# Altium project Inflador Automatico.PrjPcb
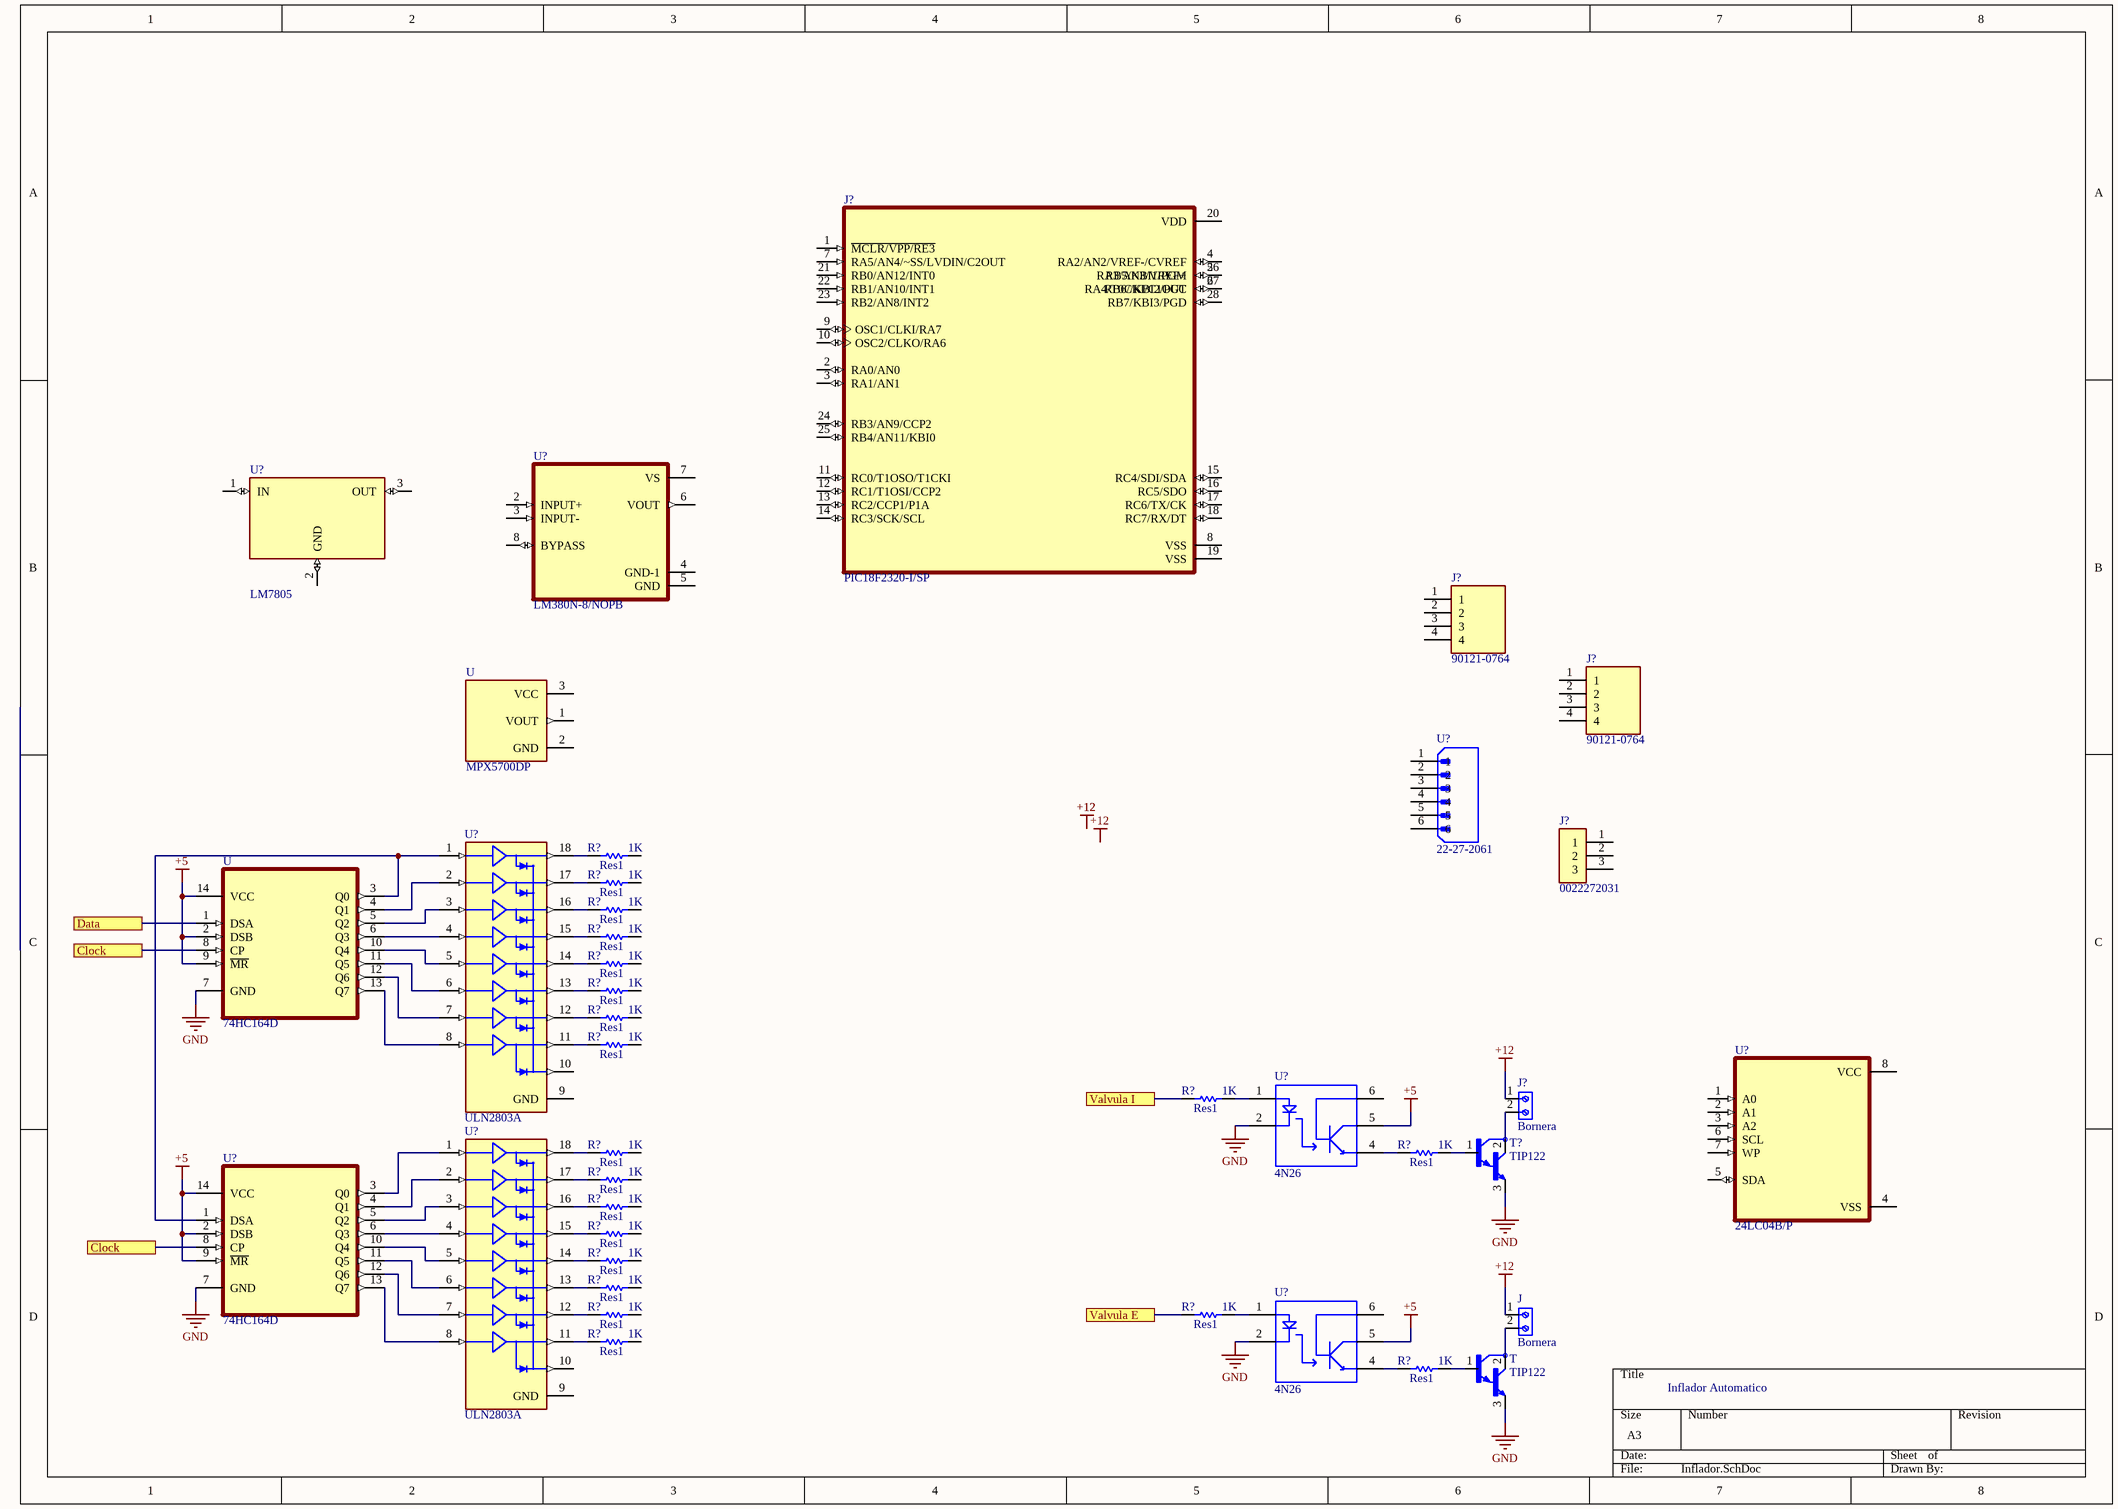
[diagram p0: Inflador.SchDoc]
1 sheet, 39 parts. Net scope: flat (ports and power ports of the same name join across sheets).

## Sheet Inflador.SchDoc
size A3; SheetNumber: 1; SheetTotal: 1

### Parts
(Parts that share a designator on the sheet are numbered #1, #2 ... from top to bottom, then left to right.)
J  Bornera  [691111710002]
J?#1  PIC18F2320-I/SP  [DIP787W46P254L3467H508Q28]
J?#2  90121-0764  [MOLEX_90121-0764]
J?#3  90121-0764  [MOLEX_90121-0764]
J?#4  0022272031  [MOLEX_0022272031]
J?#5  Bornera  [691111710002]
R?#1  Res1  value 1K  [AXIAL-0.3]
R?#2  Res1  value 1K  [AXIAL-0.3]
R?#3  Res1  value 1K  [AXIAL-0.3]
R?#4  Res1  value 1K  [AXIAL-0.3]
R?#5  Res1  value 1K  [AXIAL-0.3]
R?#6  Res1  value 1K  [AXIAL-0.3]
R?#7  Res1  value 1K  [AXIAL-0.3]
R?#8  Res1  value 1K  [AXIAL-0.3]
R?#9  Res1  value 1K  [AXIAL-0.3]
R?#10  Res1  value 1K  [AXIAL-0.3]
R?#11  Res1  value 1K  [AXIAL-0.3]
R?#12  Res1  value 1K  [AXIAL-0.3]
R?#13  Res1  value 1K  [AXIAL-0.3]
R?#14  Res1  value 1K  [AXIAL-0.3]
R?#15  Res1  value 1K  [AXIAL-0.3]
R?#16  Res1  value 1K  [AXIAL-0.3]
R?#17  Res1  value 1K  [AXIAL-0.3]
R?#18  Res1  value 1K  [AXIAL-0.3]
R?#19  Res1  value 1K  [AXIAL-0.3]
R?#20  Res1  value 1K  [AXIAL-0.3]
T  TIP122  [TO220]
T?  TIP122  [TO220]
U#1  MPX5700DP  [XDCR_MPX5700DP]
U#2  74HC164D  [SOIC127P600X175-14N]
U?#1  LM380N-8/NOPB  [DIP794W45P254L959H508Q8]
U?#2  LM7805  [TO220]
U?#3  22-27-2061  [MOLEX_22-27-2061]
U?#4  ULN2803A  [DIP850W46P254L2324H393Q18]
U?#5  4N26  [DIP762W50P254L712H480Q6]
U?#6  24LC04B/P  [DIP787W46P254L927H533Q8]
U?#7  74HC164D  [SOIC127P600X175-14N]
U?#8  ULN2803A  [DIP850W46P254L2324H393Q18]
U?#9  4N26  [DIP762W50P254L712H480Q6]

### Ports
Clock, Data, Valvula E, Valvula I

### Nets
+5: U#2.2(DSB) U#2.9(~{MR}) U#2.14(VCC) U?#5.5(COLLECTOR) U?#7.2(DSB) U?#7.9(~{MR}) U?#7.14(VCC) U?#9.5(COLLECTOR)
+12: J.1 J?#5.1
GND: T.3(E) T?.3(E) U#2.7(GND) U?#5.2(C) U?#7.7(GND) U?#9.2(C)
NetJ?#1_5: J?#1.5(RA3/AN3/VREF+) J?#1.26(RB5/KBI1/PGM)
NetJ?#1_6: J?#1.6(RA4/T0CKI/C1OUT) J?#1.27(RB6//KBI2/PGC)
NetJ?#5_2: J?#5.2 T?.2(C)
NetJ_2: J.2 T.2(C)
NetR?#1_1: R?#1.1 U?#4.18(OUT_1)
NetR?#2_1: R?#2.1 U?#4.17(OUT_2)
NetR?#3_1: R?#3.1 U?#4.16(OUT_3)
NetR?#4_1: R?#4.1 U?#4.15(OUT_4)
NetR?#5_1: R?#5.1 U?#4.14(OUT_5)
NetR?#6_1: R?#6.1 U?#4.13(OUT_6)
NetR?#7_1: R?#7.1 U?#4.12(OUT_7)
NetR?#8_1: R?#8.1 U?#4.11(OUT_8)
NetR?#9_1: R?#9.1 ; port Valvula I
NetR?#9_2: R?#9.2 U?#5.1(A)
NetR?#10_1: R?#10.1 U?#8.18(OUT_1)
NetR?#11_1: R?#11.1 U?#5.4(EMITTER)
NetR?#11_2: R?#11.2 T?.1(B)
NetR?#12_1: R?#12.1 U?#8.17(OUT_2)
NetR?#13_1: R?#13.1 U?#8.16(OUT_3)
NetR?#14_1: R?#14.1 U?#8.15(OUT_4)
NetR?#15_1: R?#15.1 U?#8.14(OUT_5)
NetR?#16_1: R?#16.1 U?#8.13(OUT_6)
NetR?#17_1: R?#17.1 U?#8.12(OUT_7)
NetR?#18_1: R?#18.1 ; port Valvula E
NetR?#18_2: R?#18.2 U?#9.1(A)
NetR?#19_1: R?#19.1 U?#8.11(OUT_8)
NetR?#20_1: R?#20.1 U?#9.4(EMITTER)
NetR?#20_2: R?#20.2 T.1(B)
NetU#2_1: U#2.1(DSA) ; port Data
NetU#2_3: U#2.3(Q0) U?#4.1(IN_1) U?#7.1(DSA)
NetU#2_4: U#2.4(Q1) U?#4.2(IN_2)
NetU#2_5: U#2.5(Q2) U?#4.3(IN_3)
NetU#2_6: U#2.6(Q3) U?#4.4(IN_4)
NetU#2_8: U#2.8(CP) U?#7.8(CP) ; port Clock
NetU#2_10: U#2.10(Q4) U?#4.5(IN_5)
NetU#2_11: U#2.11(Q5) U?#4.6(IN_6)
NetU#2_12: U#2.12(Q6) U?#4.7(IN_7)
NetU#2_13: U#2.13(Q7) U?#4.8(IN_8)
NetU?#7_3: U?#7.3(Q0) U?#8.1(IN_1)
NetU?#7_4: U?#7.4(Q1) U?#8.2(IN_2)
NetU?#7_5: U?#7.5(Q2) U?#8.3(IN_3)
NetU?#7_6: U?#7.6(Q3) U?#8.4(IN_4)
NetU?#7_10: U?#7.10(Q4) U?#8.5(IN_5)
NetU?#7_11: U?#7.11(Q5) U?#8.6(IN_6)
NetU?#7_12: U?#7.12(Q6) U?#8.7(IN_7)
NetU?#7_13: U?#7.13(Q7) U?#8.8(IN_8)

Not connected (* = marked no-connect by the designer): J?#1 1(~{MCLR/VPP/RE3}) 2(RA0/AN0) 3(RA1/AN1) 4(RA2/AN2/VREF-/CVREF) 7(RA5/AN4/~SS/LVDIN/C2OUT) 8(VSS) 9(OSC1/CLKI/RA7) 10(OSC2/CLKO/RA6) 11(RC0/T1OSO/T1CKI) 12(RC1/T1OSI/CCP2) 13(RC2/CCP1/P1A) 14(RC3/SCK/SCL) 15(RC4/SDI/SDA) 16(RC5/SDO) 17(RC6/TX/CK) 18(RC7/RX/DT) 19(VSS) 20(VDD) 21(RB0/AN12/INT0) 22(RB1/AN10/INT1) 23(RB2/AN8/INT2) 24(RB3/AN9/CCP2) 25(RB4/AN11/KBI0) 28(RB7/KBI3/PGD); J?#2 1 2 3 4; J?#3 1 2 3 4; J?#4 1 2 3; R?#1 2; R?#2 2; R?#3 2; R?#4 2; R?#5 2; R?#6 2; R?#7 2; R?#8 2; R?#10 2; R?#12 2; R?#13 2; R?#14 2; R?#15 2; R?#16 2; R?#17 2; R?#19 2; U#1 1(VOUT) 2(GND) 3(VCC); U?#1 2(INPUT+) 3(INPUT-) 4(GND-1) 5(GND) 6(VOUT) 7(VS) 8(BYPASS); U?#2 1(IN) 2(GND) 3(OUT); U?#3 1 2 3 4 5 6; U?#4 9(GND) 10(COMMON); U?#5 6(BASE); U?#6 1(A0) 2(A1) 3(A2) 4(VSS) 5(SDA) 6(SCL) 7(WP) 8(VCC); U?#8 9(GND) 10(COMMON); U?#9 6(BASE)

### Notes on the sheet
- Inflador Automatico
- Labels drawn without touching a wire or pin: +12

### Library data of the parts
J J?#5 = 691111710002: 2 Position Wire to Board Terminal Block Horizontal with Board 0.197 _5.00mm_ Through Hole; MF: Wurth Electronics; Value: *; Availability: Unavailable; MP: 691111710002; Price: None; Package: None; SnapEDA_Link: https://www.snapeda.com/parts/691111710002/Wurth%20Electronics%20Inc./view-part/1195092/?ref=snap
J?#2 J?#3 = 90121-0764: Connector Header Through Hole, Right Angle 4 position 0.100" (2.54mm); Package: None; Price: None; Value: *; MP: 90121-0764; Availability: Unavailable
J?#4 = 0022272031: Connector Header Through Hole 3 position 0.100 (2.54mm); MF: Molex; MP: 0022272031; Price: None; SnapEDA_Link: https://www.snapeda.com/parts/0022272031/Molex/view-part/?ref=snap; Check_prices: https://www.snapeda.com/parts/0022272031/Molex/view-part/?ref=eda; Package: None; Availability: In Stock; Value: *
R?#1-R?#20 = Res1: Resistor; Published: 8-Jun-2000; LatestRevisionDate: 17-Jul-2002; LatestRevisionNote: Re-released for DXP Platform.; PackageReference: AXIAL-0.3; Publisher: Altium Limited; PackageDescription: Axial Device, Thru-Hole; 2 Leads; 0.3 in Pin Spacing
T T? = TIP122: Bipolar _BJT_ Transistor NPN - Darlington 100V 5A 2W Through Hole TO-220AB; MF: ON Semiconductor; Package: TO-220 Fairchild Semiconductor; Value: *; MP: TIP122; Price: None; SnapEDA_Link: https://www.snapeda.com/parts/TIP122/ON%20Semiconductor/view-part/315945/?ref=snap; Availability: Unavailable
U#1 = MPX5700DP: Pressure Sensor 101.53PSI _700kPa_ Differential Male - 0.19 _4.93mm_ Tube, Dual 0.2 V ~ 4.7 V 6-SIP Module; MF: NXP USA; Availability: Unavailable; SnapEDA_Link: https://www.snapeda.com/parts/MPX5700DP/NXP%20USA%20Inc./view-part/1784979/?ref=snap; MP: MPX5700DP; Price: None; Value: *; Package: SIP-6 NXP Semiconductors
U#2 U?#7 = 74HC164D: Shift Shift Register 1 Element 8 Bit 14-SOP; MF: Toshiba Semiconductor; Package: SOP-14 Nexperia; DigiKey-Purchase-URL: https://snapeda.com/shop?store=DigiKey&id=2732286; Price: None; Availability: Unavailable; MP: 74HC164D; SnapEDA_Link: https://www.snapeda.com/parts/74HC164D/Toshiba%20Semiconductor%20and%20Storage/view-part/2732286/?ref=snap; Value: *
U?#3 = 22-27-2061: Headers & Wire Housings STRT LOCKING HEADER; MF: Molex; Purchase-URL: https://pricing.snapeda.com/search/part/22-27-2061/?ref=eda; SnapEDA_Link: https://www.snapeda.com/parts/22-27-2061/Molex/view-part/5291808/?ref=snap; Package: None; Price: None; Value: *; Availability: Warning; MP: 22-27-2061; Check_prices: https://www.snapeda.com/parts/22-27-2061/Molex/view-part/5291808/?ref=eda
U?#4 U?#8 = ULN2803A: Bipolar (BJT) Transistor Array 8 NPN Darlington 50V 500mA 2.25W Through Hole 18-DIP; Package: None; Availability: Unavailable; Value: *; MP: ULN2803A; Price: None
U?#5 U?#9 = 4N26: Optoisolator Transistor with Base Output 5000Vrms 1 Channel 6-DIP; MF: Vishay Semiconductor; SnapEDA_Link: https://www.snapeda.com/parts/4N26/Vishay%20Semiconductor%20Opto%20Division/view-part/1195025/?ref=snap; Availability: Unavailable; MP: 4N26; Value: *; Price: None; Package: DIP-6 Lite-On
J?#1 = PIC18F2320-I/SP: Package: None; Price: None; Value: *; MP: PIC18F2320-I/SP; Availability: Unavailable
U?#1 = LM380N-8/NOPB: Package: None; Price: None; Value: *; MP: LM380N-8/NOPB; Availability: Unavailable
U?#2 = LM7805: Package: None; Availability: Unavailable; Value: *; MP: LM7805; Price: None
U?#6 = 24LC04B/P: Package: None; Price: None; Value: *; MP: 24LC04B/P; Availability: Unavailable